# Altium schematic sheet OV5640_Module_Connect.SchDoc
size A
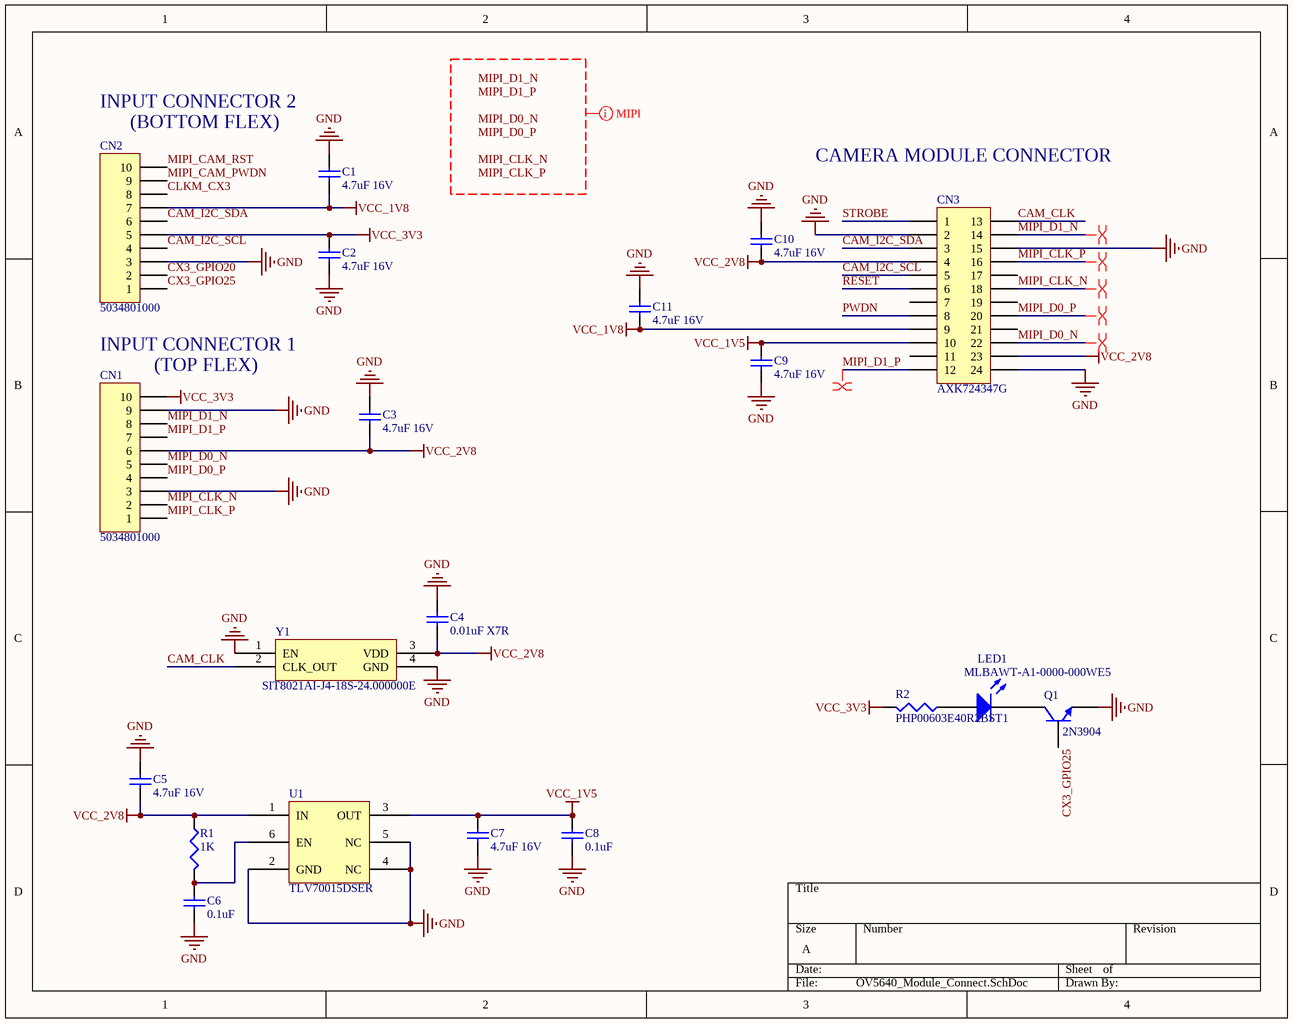
[diagram p0: OV5640_Module_Connect.SchDoc]

## Parts
C1  4.7uF 16V  [1608[0603]]
C2  4.7uF 16V  [1608[0603]]
C3  4.7uF 16V  [1608[0603]]
C4  0.01uF X7R  [0402]
C5  4.7uF 16V  [1608[0603]]
C6  0.1uF  [0402]
C7  4.7uF 16V  [1608[0603]]
C8  0.1uF  [0402]
C9  4.7uF 16V  [1608[0603]]
C10  4.7uF 16V  [1608[0603]]
C11  4.7uF 16V  [1608[0603]]
CN1  5034801000  [5034801000]
CN2  5034801000  [5034801000]
CN3  AXK724347G  [AXK724347G]
LED1  MLBAWT-A1-0000-000WE5  [Cree ML-B LEB]
Q1  2N3904  [SOT-23]
R1  1K  [0402]
R2  PHP00603E40R2BST1  [J1-0603]
U1  TLV70015DSER  [TLV70015DSER]
Y1  SIT8021AI-J4-18S-24.000000E  [SIT8021AI-J4-18S-24.000000E]

## Nets
GND: C1.2 C2.1 C3.2 C4.2 C5.2 C6.1 C7.1 C8.1 C9.1 C10.2 C11.2 CN1.3 CN1.9 CN2.3 CN3.2 CN3.15 CN3.24 Q1.1(E) U1.2(GND) U1.4(NC) U1.5(NC) Y1.1(EN) Y1.4(GND)
VCC_1V5: C7.2 C8.2 C9.2 CN3.10 U1.3(OUT)
VCC_1V8: C1.1 C11.1 CN2.7 CN3.9
VCC_2V8: C3.1 C4.1 C5.1 C10.1 CN1.6 CN3.4 CN3.23 R1.1 U1.1(IN) Y1.3(VDD)
VCC_3V3: C2.2 CN1.10 CN2.5 R2.2
CAM_CLK: CN3.13 Y1.2(CLK_OUT)
CAM_I2C_SCL: CN2.4 CN3.5
CAM_I2C_SDA: CN2.6 CN3.3
CLKM_CX3: CN2.8
CX3_GPIO20: CN2.2
CX3_GPIO25: CN2.1 Q1.2(B)
MIPI_CAM_PWDN: CN2.9
MIPI_CAM_RST: CN2.10
MIPI_CLK_N: CN1.2 CN3.18
MIPI_CLK_P: CN1.1 CN3.16
MIPI_D0_N: CN1.5 CN3.22
MIPI_D0_P: CN1.4 CN3.20
MIPI_D1_N: CN1.8 CN3.14
MIPI_D1_P: CN1.7 CN3.12
PWDN: CN3.8
RESET: CN3.6
STROBE: CN3.1
NetC6_2: C6.2 R1.2 U1.6(EN)
NetLED1_1: LED1.1(A) R2.1
NetLED1_2: LED1.2(K) Q1.3(C)

Not connected (* = marked no-connect by the designer): CN3 7 11 17 19 21

## Layout directives
net class MIPI2: MIPI_CLK_N, MIPI_CLK_P, MIPI_D0_N, MIPI_D0_P, MIPI_D1_N, MIPI_D1_P
differential pair: MIPI_CLK_N, MIPI_CLK_P, MIPI_D0_N, MIPI_D0_P, MIPI_D1_N, MIPI_D1_P

## Notes on the sheet
- INPUT CONNECTOR 2
- (near CN2) (BOTTOM FLEX)
- CAMERA MODULE CONNECTOR
- INPUT CONNECTOR 1
- (near CN1) (TOP FLEX)
- Labels drawn without touching a wire or pin: MIPI_CLK_N, MIPI_CLK_P, MIPI_D0_N, MIPI_D0_P, MIPI_D1_N, MIPI_D1_P

## Library data of the parts
C1-C3 C5 C7 C9-C11 = Cap Semi: Capacitor (Semiconductor SIM Model); Published: 8-Jun-2000; LatestRevisionDate: 29-May-2009; LatestRevisionNote: IPC-7351 Footprint Added.; PackageReference: C1206; Publisher: Altium Limited; PackageDescription: Chip Capacitor; Value: 4.7uF
C4 C6 C8 = Cap Semi: Capacitor (Semiconductor SIM Model); Value: 4.7uF; Published: 8-Jun-2000; LatestRevisionDate: 29-May-2009; LatestRevisionNote: IPC-7351 Footprint Added.; PackageReference: C1206; Publisher: Altium Limited; PackageDescription: Chip Capacitor
CN1 CN2 = Header 10: Header, 10-Pin; LatestRevisionDate: 17-Jul-2002; LatestRevisionNote: Re-released for DXP Platform.; Publisher: Altium Limited
CN3 = Header 12X2A: Header, 12-Pin, Dual row; LatestRevisionDate: 17-Jul-2002; LatestRevisionNote: Re-released for DXP Platform.; Publisher: Altium Limited
LED1 = LED3: Typical BLUE SiC LED; Published: 8-Jun-2000; LatestRevisionDate: 17-Dec-2003; LatestRevisionNote: PCB Footprint replaced.; DatasheetVersion: 16-Apr-2002; PackageVersion: 16-Apr-2002; PackageReference: 3.5X2.8X1.9; Publisher: Altium Limited; PackageDescription: SM LED; 2 C-Bend Leads; Body 3.5 x 2.8 x 1.9 mm, inc leads (LxWxH typ)
Q1 = 2N3904: NPN General Purpose Amplifier; Published: 8-Jun-2000; LatestRevisionDate: 15-Jan-2003; LatestRevisionNote: PCB Footprint 'BCY-W3/D4.7' replaced; DatasheetVersion: 1997; PackageVersion: Sep-1998; PackageReference: TO-92A; Publisher: Altium Limited; PackageDescription: TO, Flat Index; 3 In-Line, Axial Leads; Body Dia. 4.5mm; Leads 0.51 x 0.48 mm (max); ComponentLink1Description: Manufacturer Link; ComponentLink1URL: http://www.fairchildsemi.com/; ComponentLink2Description: Datasheet; ComponentLink2URL: http://www.fairchildsemi.com/ds/2N%2F2N3904.pdf
R1 R2 = Res3: Resistor; Value: 22E; Published: 8-Jun-2000; LatestRevisionDate: 29-May-2009; LatestRevisionNote: IPC-7351 Footprint Added.; PackageReference: J1-0603; Publisher: Altium Limited; PackageDescription: Chip Resistor
Y1 = OSCILLATOR_2